# Altium schematic sheet VREG_3V3.SchDoc
size A4
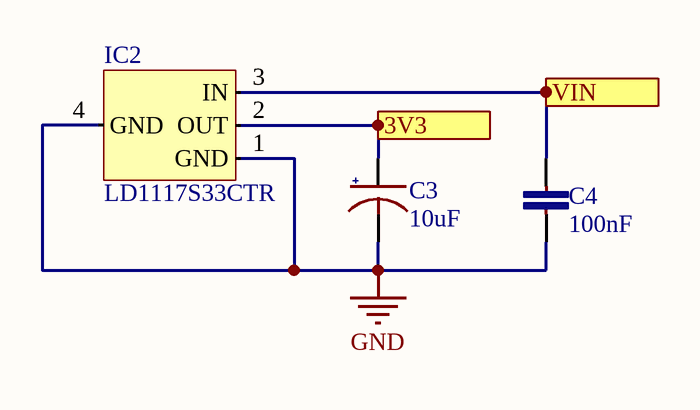
[diagram p0: VREG_3V3.SchDoc]

## Parts
C3  10uF  [CAP ALUM 5X5]
C4  100nF  [CAP CER 0603]
IC2  LD1117S33CTR  [SOT-223]

## Ports
3V3 (out), VIN (in)

## Nets
GND: C3.2 C4.2 IC2.1(GND) IC2.4(GND)
3V3: C3.1 IC2.2(OUT) ; port 3V3
VIN: C4.1 IC2.3(IN) ; port VIN

## Library data of the parts
C3 = CAP ALUM 25V 10uF: Aluminum Electrolytic Capacitors - SMD 25volts 10uF 5x5.4 20%; Mfr: Nichion; Mfr Nr: UWX1E100MCL1GB; Voltage Rating: 25V; Type: Surface Mount Aluminum Electrolytic Capacitor; Dimensions: 5x5mm; Series: UWX; Value: 10uF
C4 = CAP CER 0603 25V 100nF: Multilayer Ceramic Capacitors MLCC - SMD/SMT 25V 0.1uF 0603 Y5V -20/+80%; Mfr Nr: C0603C104Z3VACTU; Mfr: KEMET; Type: Ceramic Capacitor; Dimensions: 0603 (1608 metric); Value: 100nF; Voltage Rating: 25V; Series: SMD Comm Y5V
IC2 = LD1117S33CTR: LDO Voltage Regulators 3.3V 0.8A Positive; Mfr: STMicroelectronics; Series: LD1117; Package: SOT-223-3